# Altium schematic sheet 可调液晶原理图.SchDoc
size A4
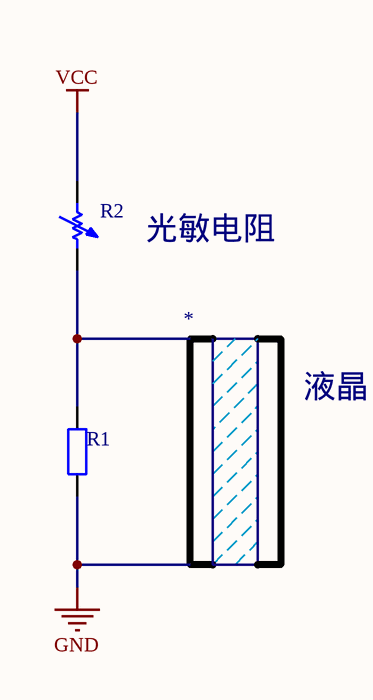
[diagram p0: 可调液晶原理图.SchDoc]

## Parts
*  Component_1  (value not drawn)
R1  Res2  [AXIAL-0.4]  (value not drawn)
R2  Res Adj1  [AXIAL-0.7]  (value not drawn)

## Nets
GND: R1.1
VCC: R2.1
NetR1_2: R1.2 R2.2

## Notes on the sheet
- 光敏电阻
- 液晶

## Library data of the parts
R1 = Res2: Resistor; Published: 8-Jun-2000; LatestRevisionDate: 17-Jul-2002; LatestRevisionNote: Re-released for DXP Platform.; PackageReference: AXIAL-0.4; Publisher: Altium Limited
R2 = Res Adj1: Variable Resistor; Set Position: 0.5; Published: 8-Jun-2000; LatestRevisionDate: 17-Jul-2002; LatestRevisionNote: Re-released for DXP Platform.; PackageReference: AXIAL-0.7; Publisher: Altium Limited